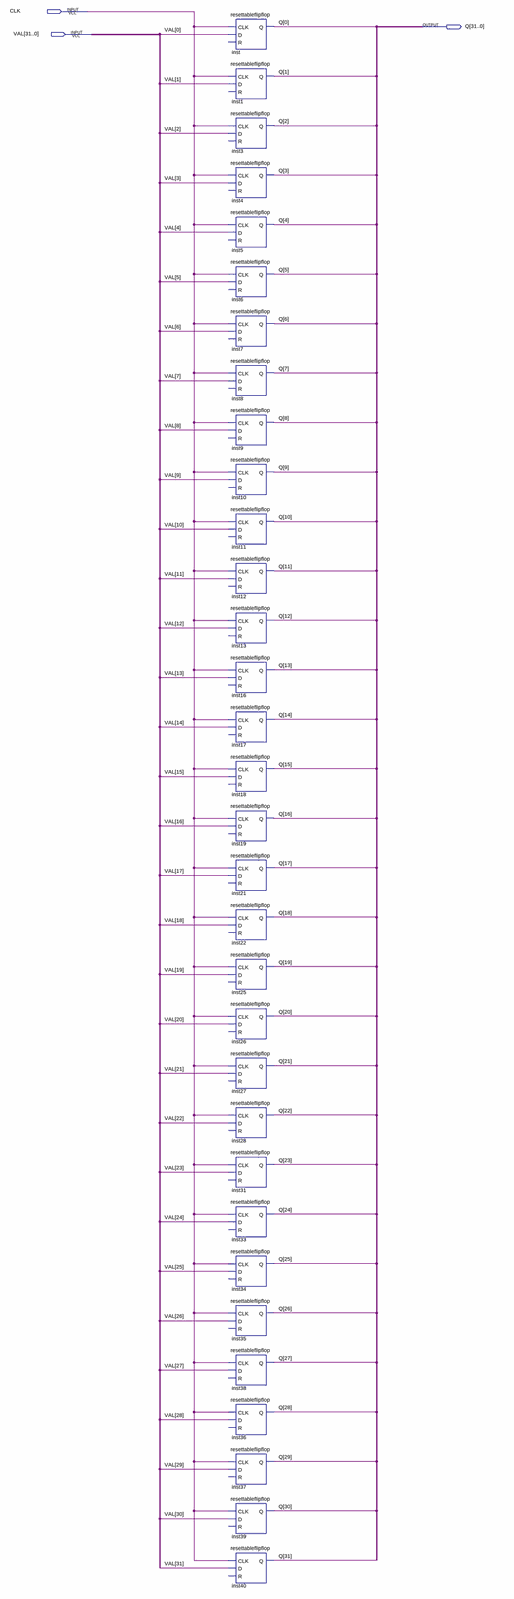
[diagram p0: schematic sheet, whole]
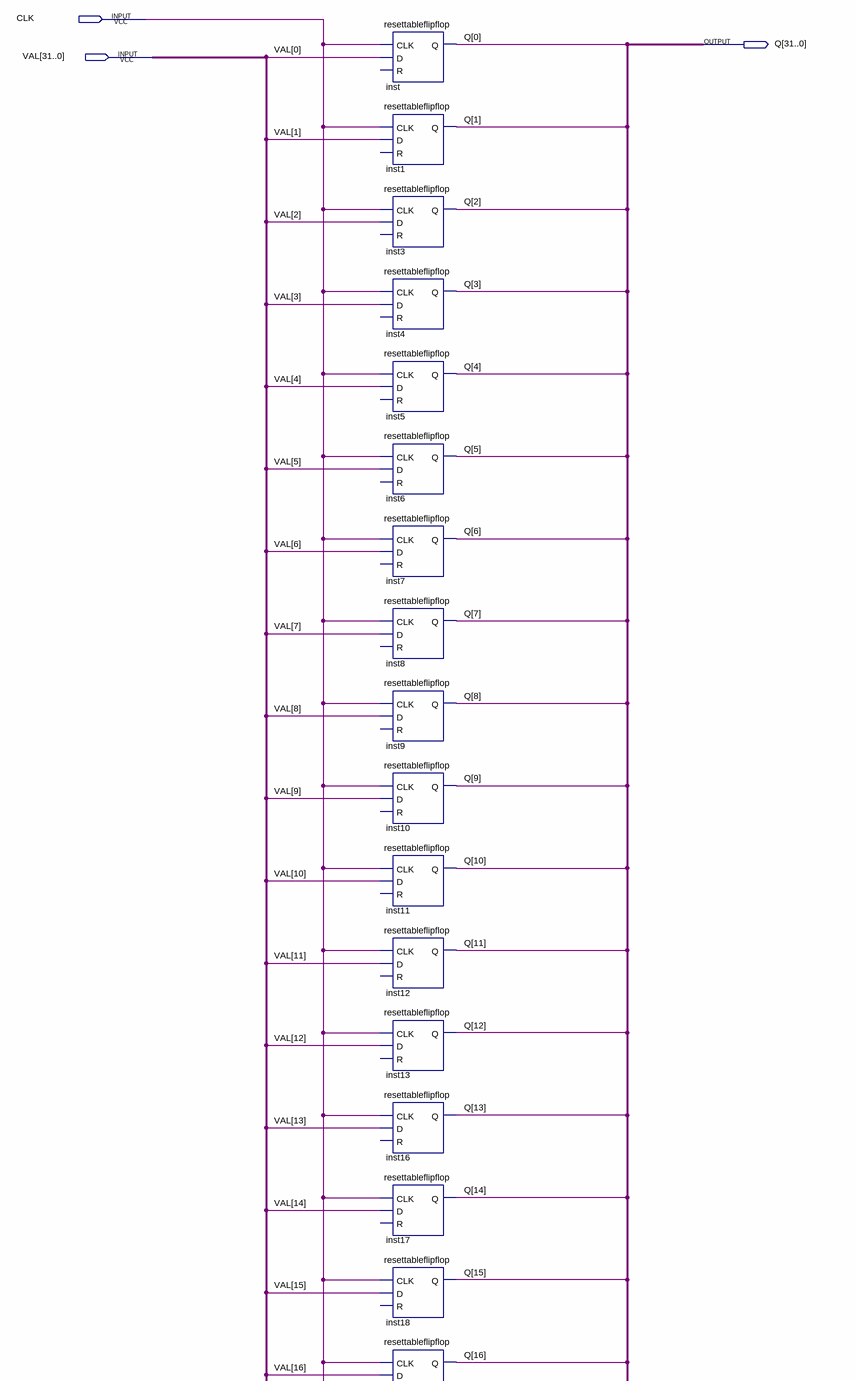
[diagram p1: schematic sheet, upper part]
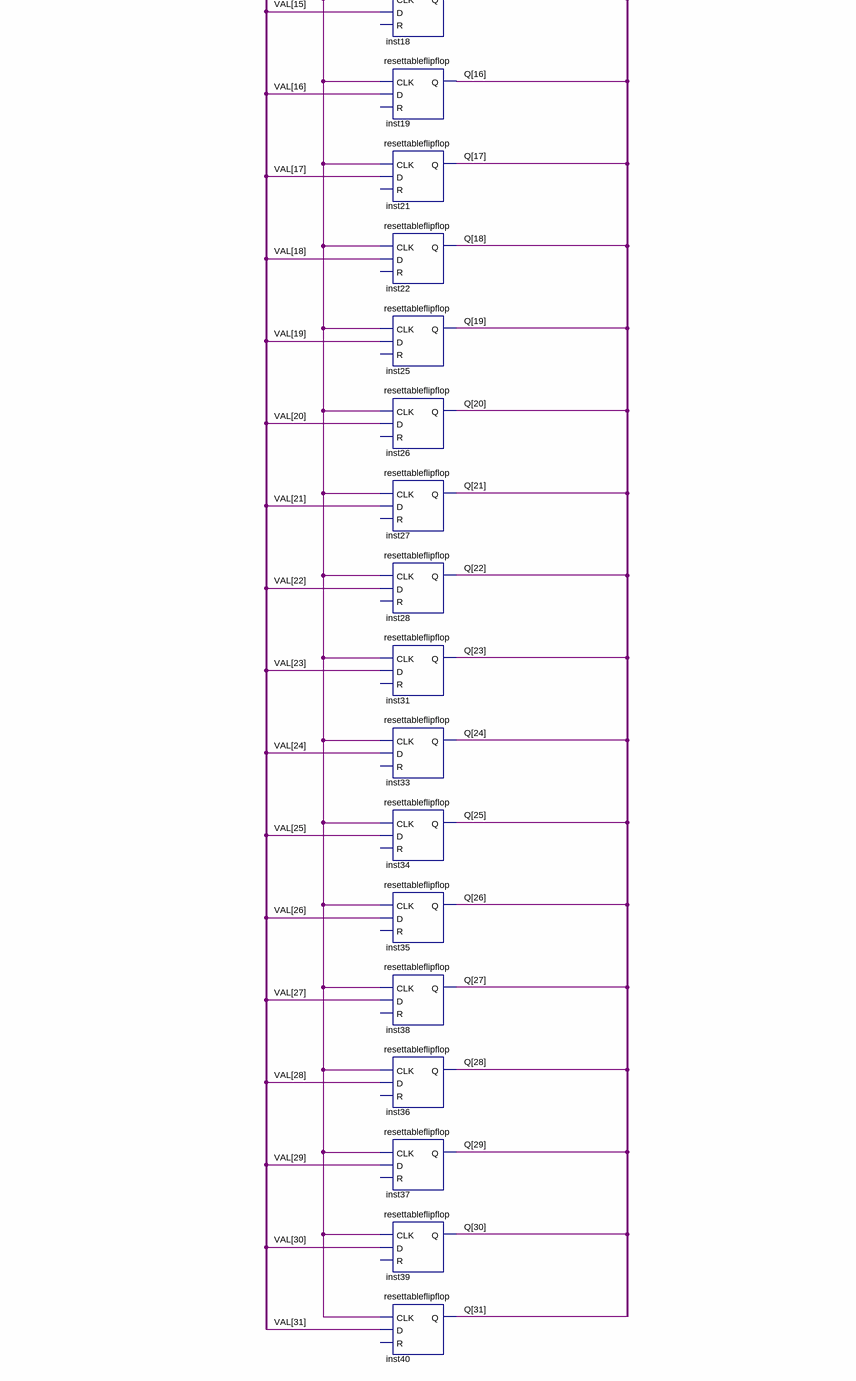
[diagram p2: schematic sheet, lower part]
// Quartus schematic newpc.bdf as structural Verilog: 32 symbols, 3 pins
module newpc (
  input  CLK,
  input  [31:0] VAL,
  output [31:0] Q
);

  resettableflipflop inst (.CLK(CLK), .D(VAL[0]), .Q(Q[0]));  // open: R
  resettableflipflop inst1 (.CLK(CLK), .D(VAL[1]), .Q(Q[1]));  // open: R
  resettableflipflop inst3 (.CLK(CLK), .D(VAL[2]), .Q(Q[2]));  // open: R
  resettableflipflop inst4 (.CLK(CLK), .D(VAL[3]), .Q(Q[3]));  // open: R
  resettableflipflop inst5 (.CLK(CLK), .D(VAL[4]), .Q(Q[4]));  // open: R
  resettableflipflop inst6 (.CLK(CLK), .D(VAL[5]), .Q(Q[5]));  // open: R
  resettableflipflop inst7 (.CLK(CLK), .D(VAL[6]), .Q(Q[6]));  // open: R
  resettableflipflop inst8 (.CLK(CLK), .D(VAL[7]), .Q(Q[7]));  // open: R
  resettableflipflop inst9 (.CLK(CLK), .D(VAL[8]), .Q(Q[8]));  // open: R
  resettableflipflop inst10 (.CLK(CLK), .D(VAL[9]), .Q(Q[9]));  // open: R
  resettableflipflop inst11 (.CLK(CLK), .D(VAL[10]), .Q(Q[10]));  // open: R
  resettableflipflop inst12 (.CLK(CLK), .D(VAL[11]), .Q(Q[11]));  // open: R
  resettableflipflop inst13 (.CLK(CLK), .D(VAL[12]), .Q(Q[12]));  // open: R
  resettableflipflop inst16 (.CLK(CLK), .D(VAL[13]), .Q(Q[13]));  // open: R
  resettableflipflop inst17 (.CLK(CLK), .D(VAL[14]), .Q(Q[14]));  // open: R
  resettableflipflop inst18 (.CLK(CLK), .D(VAL[15]), .Q(Q[15]));  // open: R
  resettableflipflop inst19 (.CLK(CLK), .D(VAL[16]), .Q(Q[16]));  // open: R
  resettableflipflop inst21 (.CLK(CLK), .D(VAL[17]), .Q(Q[17]));  // open: R
  resettableflipflop inst22 (.CLK(CLK), .D(VAL[18]), .Q(Q[18]));  // open: R
  resettableflipflop inst25 (.CLK(CLK), .D(VAL[19]), .Q(Q[19]));  // open: R
  resettableflipflop inst26 (.CLK(CLK), .D(VAL[20]), .Q(Q[20]));  // open: R
  resettableflipflop inst27 (.CLK(CLK), .D(VAL[21]), .Q(Q[21]));  // open: R
  resettableflipflop inst28 (.CLK(CLK), .D(VAL[22]), .Q(Q[22]));  // open: R
  resettableflipflop inst31 (.CLK(CLK), .D(VAL[23]), .Q(Q[23]));  // open: R
  resettableflipflop inst33 (.CLK(CLK), .D(VAL[24]), .Q(Q[24]));  // open: R
  resettableflipflop inst34 (.CLK(CLK), .D(VAL[25]), .Q(Q[25]));  // open: R
  resettableflipflop inst35 (.CLK(CLK), .D(VAL[26]), .Q(Q[26]));  // open: R
  resettableflipflop inst38 (.CLK(CLK), .D(VAL[27]), .Q(Q[27]));  // open: R
  resettableflipflop inst36 (.CLK(CLK), .D(VAL[28]), .Q(Q[28]));  // open: R
  resettableflipflop inst37 (.CLK(CLK), .D(VAL[29]), .Q(Q[29]));  // open: R
  resettableflipflop inst39 (.CLK(CLK), .D(VAL[30]), .Q(Q[30]));  // open: R
  resettableflipflop inst40 (.CLK(CLK), .D(VAL[31]), .Q(Q[31]));  // open: R
endmodule
